# EAGLE schematic FLEXQCM V1.1 (EAGLE 7.2.0)
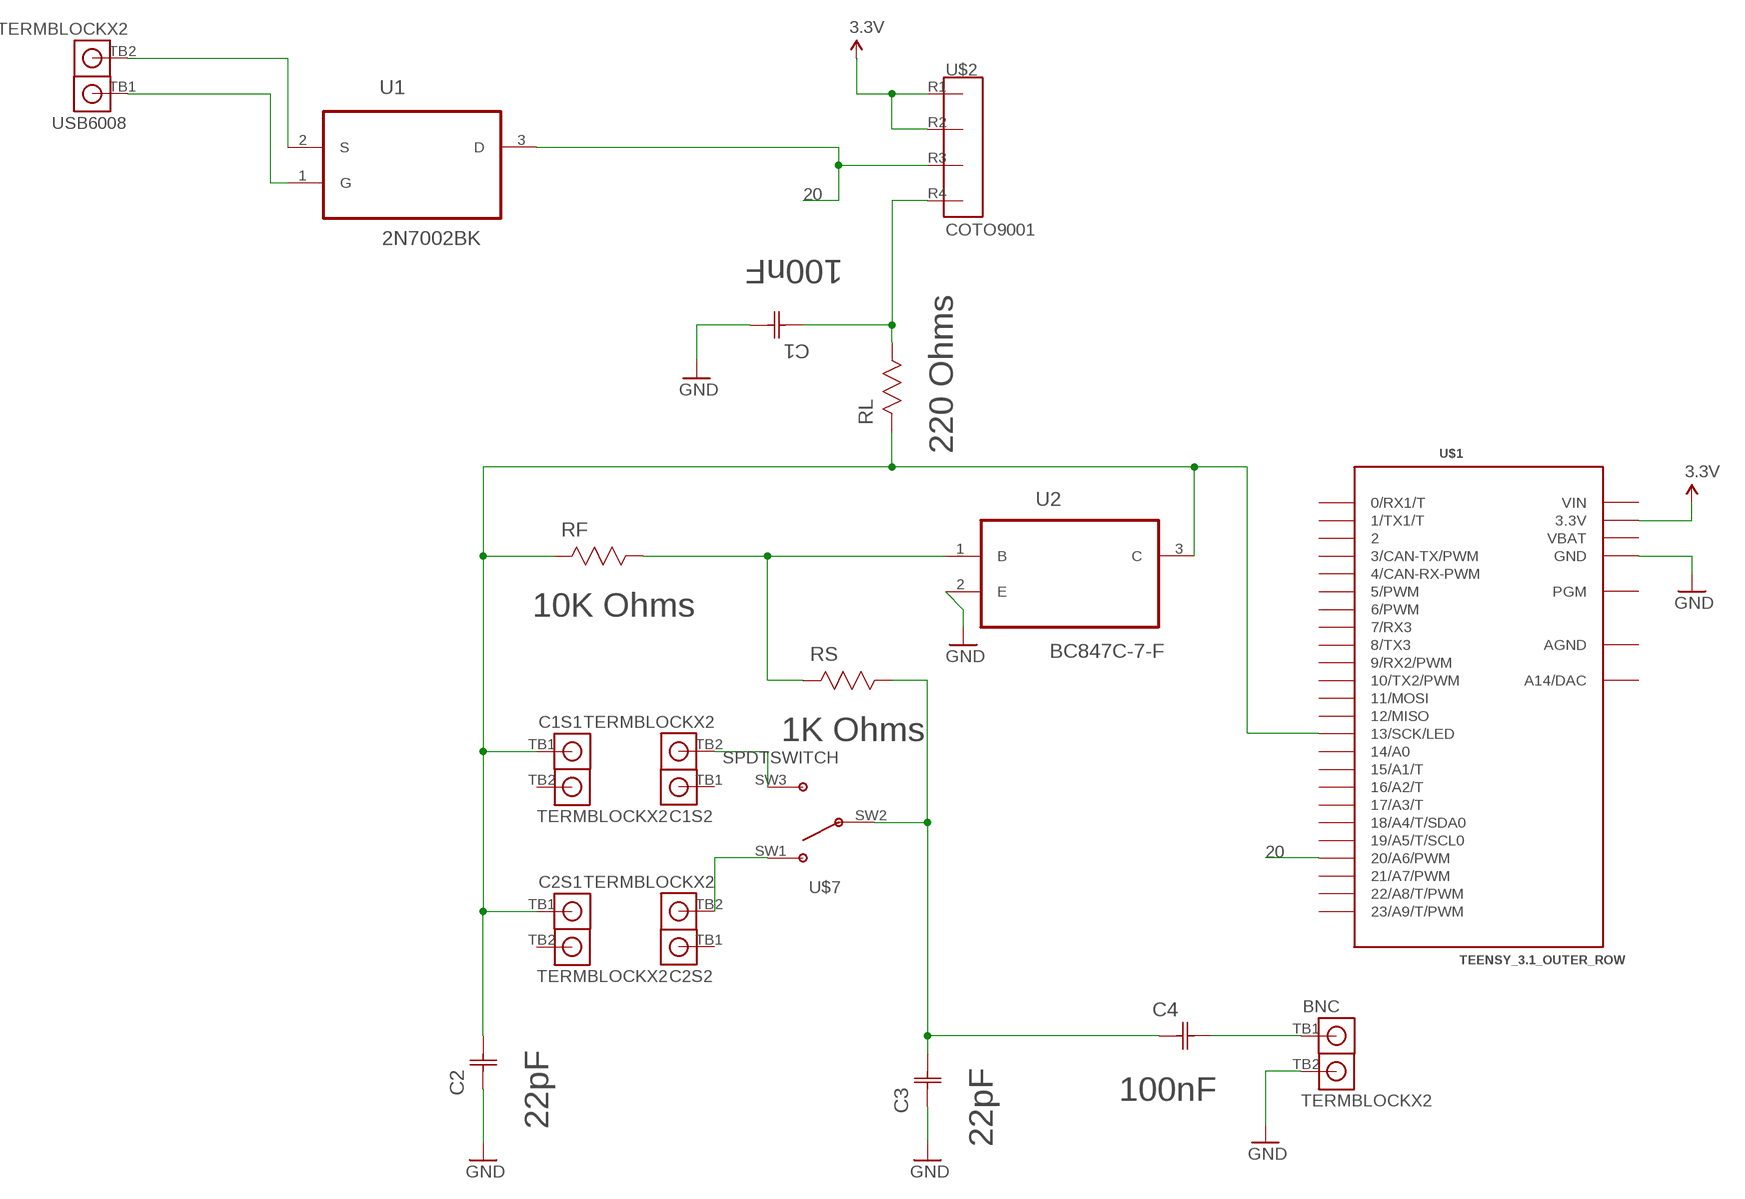
[diagram p0: schematic, sheet 1]

## Parts
BNC  TERMBLOCKX2  [TERMBLOCKX2]
C1  100nF  C1206C104K1RACTU  [CAPC3216X88N]
C1S1  TERMBLOCKX2  [TERMBLOCKX2]
C1S2  TERMBLOCKX2  [TERMBLOCKX2]
C2  22pF  C1206C220J5GACTU  [CAPC3216X88N]
C2S1  TERMBLOCKX2  [TERMBLOCKX2]
C2S2  TERMBLOCKX2  [TERMBLOCKX2]
C3  22pF  C1206C220J5GACTU  [CAPC3216X88N]
C4  100nF  C1206C104K1RACTU  [CAPC3216X88N]
RF  10K Ohms  CRCW120610K0FKEA  [RESC3216X71N]
RL  220 Ohms  CRCW1206220RJNEA  [RESC3216X71N]
RS  1K Ohms  CRCW12061K00FKEA  [RESC3216X71N]
U1  2N7002BK  [SOT95P230X110-3N]
U2  BC847C-7-F  [SOT103P240X110-3N]
U$1  TEENSY_3.1_OUTER_ROW  [TEENSY3-OUTER_ROW]
U$2  COTO9001  [COTO9001]
U$7  SPDTSWITCH  [SPDTSWITCH]
USB6008  TERMBLOCKX2  [TERMBLOCKX2]

## Nets
3V3: U$1.3.3V U$1.3.3V1(3.3V) U$2.R1 U$2.R2 ; supply symbol labelled 3.3V
13: C1S1.TB1 C2.2(C2) C2S1.TB1 RF.2 RL.2 U2.3(C) U$1.13(13/SCK/LED)
20: U1.3(D) U$1.20/A6(20/A6/PWM) U$2.R3
GND: BNC.TB2 C1.2(C2) C2.1(C1) C3.1(C1) U2.2(E) U$1.GND U$1.GND1(GND)
N$2: U1.2(S) USB6008.TB2
N$3: U1.1(G) USB6008.TB1
N$4: C1.1(C1) RL.1 U$2.R4
N$5: C1S2.TB2 U$7.SW3
N$6: RF.1 RS.2 U2.1(B)
N$7: C2S2.TB2 U$7.SW1
N$8: C3.2(C2) C4.1(C1) RS.1 U$7.SW2
N$9: BNC.TB1 C4.2(C2)
Unconnected: C1S1.TB2 C1S2.TB1 C2S1.TB2 C2S2.TB1 U$1.0(0/RX1/T) U$1.1(1/TX1/T) U$1.2 U$1.3(3/CAN-TX/PWM) U$1.4(4/CAN-RX-PWM) U$1.5(5/PWM) U$1.6(6/PWM) U$1.7(7/RX3) U$1.8(8/TX3) U$1.9(9/RX2/PWM) U$1.10(10/TX2/PWM) U$1.11(11/MOSI) U$1.12(12/MISO) U$1.14/A0 U$1.15/A1(15/A1/T) U$1.16/A2(16/A2/T) U$1.17/A3(17/A3/T) U$1.18/A4(18/A4/T/SDA0) U$1.19/A5(19/A5/T/SCL0) U$1.21/A7(21/A7/PWM) U$1.22/A8(22/A8/T/PWM) U$1.23/A9(23/A9/T/PWM) U$1.PGM U$1.RESET/DAC(A14/DAC)

## Power pins joined to a net without a drawn wire
AGND: U$1.AGND
VBAT: U$1.VBAT
VIN: U$1.VIN

## Library data of the parts
BNC C1S1 C1S2 C2S1 C2S2 USB6008 = FLEXQCMLIBRARY:TERMBLOCKX2
C1 C4 = Kemet_By_element14_Batch_1:C1206C104K1RACTU: CAPACITOR, 1206; MPN: C1206C104K1RACTU; OC_FARNELL: 1414714; OC_NEWARK: 85C2205; SUPPLIER: Kemet; TOLERANCE: ±10%; VOLTAGERATING: 100V
C2 C3 = Kemet_By_element14_Batch_1:C1206C220J5GACTU: CAPACITOR, 1206; MPN: C1206C220J5GACTU; OC_FARNELL: 1414717; OC_NEWARK: 70K9304; SUPPLIER: Kemet; TOLERANCE: ±5%; VOLTAGERATING: 50V
RF = Vishay_By_element14_Batch_1:CRCW120610K0FKEA: RESISTOR, 1206; MPN: CRCW120610K0FKEA; OC_FARNELL: 1469970; OC_NEWARK: 53K1907; SUPPLIER: Vishay; TOLERANCE: ±1%; WATTAGE: 0.25W
RL = Vishay_By_element14_Batch_1:CRCW1206220RJNEA: RESISTOR, 1206; MPN: CRCW1206220RJNEA; OC_FARNELL: -; OC_NEWARK: 59M6970; SUPPLIER: Vishay; TOLERANCE: ±5%; WATTAGE: 0.25W
RS = Vishay_By_element14_Batch_1:CRCW12061K00FKEA: RESISTOR, 1206; MPN: CRCW12061K00FKEA; OC_FARNELL: 1469965; OC_NEWARK: 53K1780; SUPPLIER: Vishay; TOLERANCE: ±1%; WATTAGE: 0.25W
U1 = NXP_By_element14_Batch_1:2N7002BK: MOSFET; MPN: 2N7002BK; OC_FARNELL: 1859847; OC_NEWARK: 28T0305; PACKAGE: SOT-23-3; SUPPLIER: NXP
U2 = Diodes_Inc_By_element14_Batch_1:BC847C-7-F: NPN SURFACE MOUNT SMALL SIGNAL TRANSISTOR; MPN: BC847C-7-F; OC_FARNELL: 1773609; OC_NEWARK: 51R6395; PACKAGE: SOT-23-3; SUPPLIER: DIODES INC.
U$1 = Teensy_3_and_LC_Series_Boards_v1.0:TEENSY_3.1_OUTER_ROW: Footprint for Teensy 3.1 or 3.2 board using all pin connections on the outer perimeter
U$2 = FLEXQCMLIBRARY:COTO9001
U$7 = FLEXQCMLIBRARY:SPDTSWITCH